# Altium schematic sheet 28PINS SCHEMATIC.SchDoc
size A2; CompanyName: (c) FEDEVEL ACADEMY 2015; SheetNumber: 3; SheetTotal: 5; NotFitted: NF; VersionRevision: V111
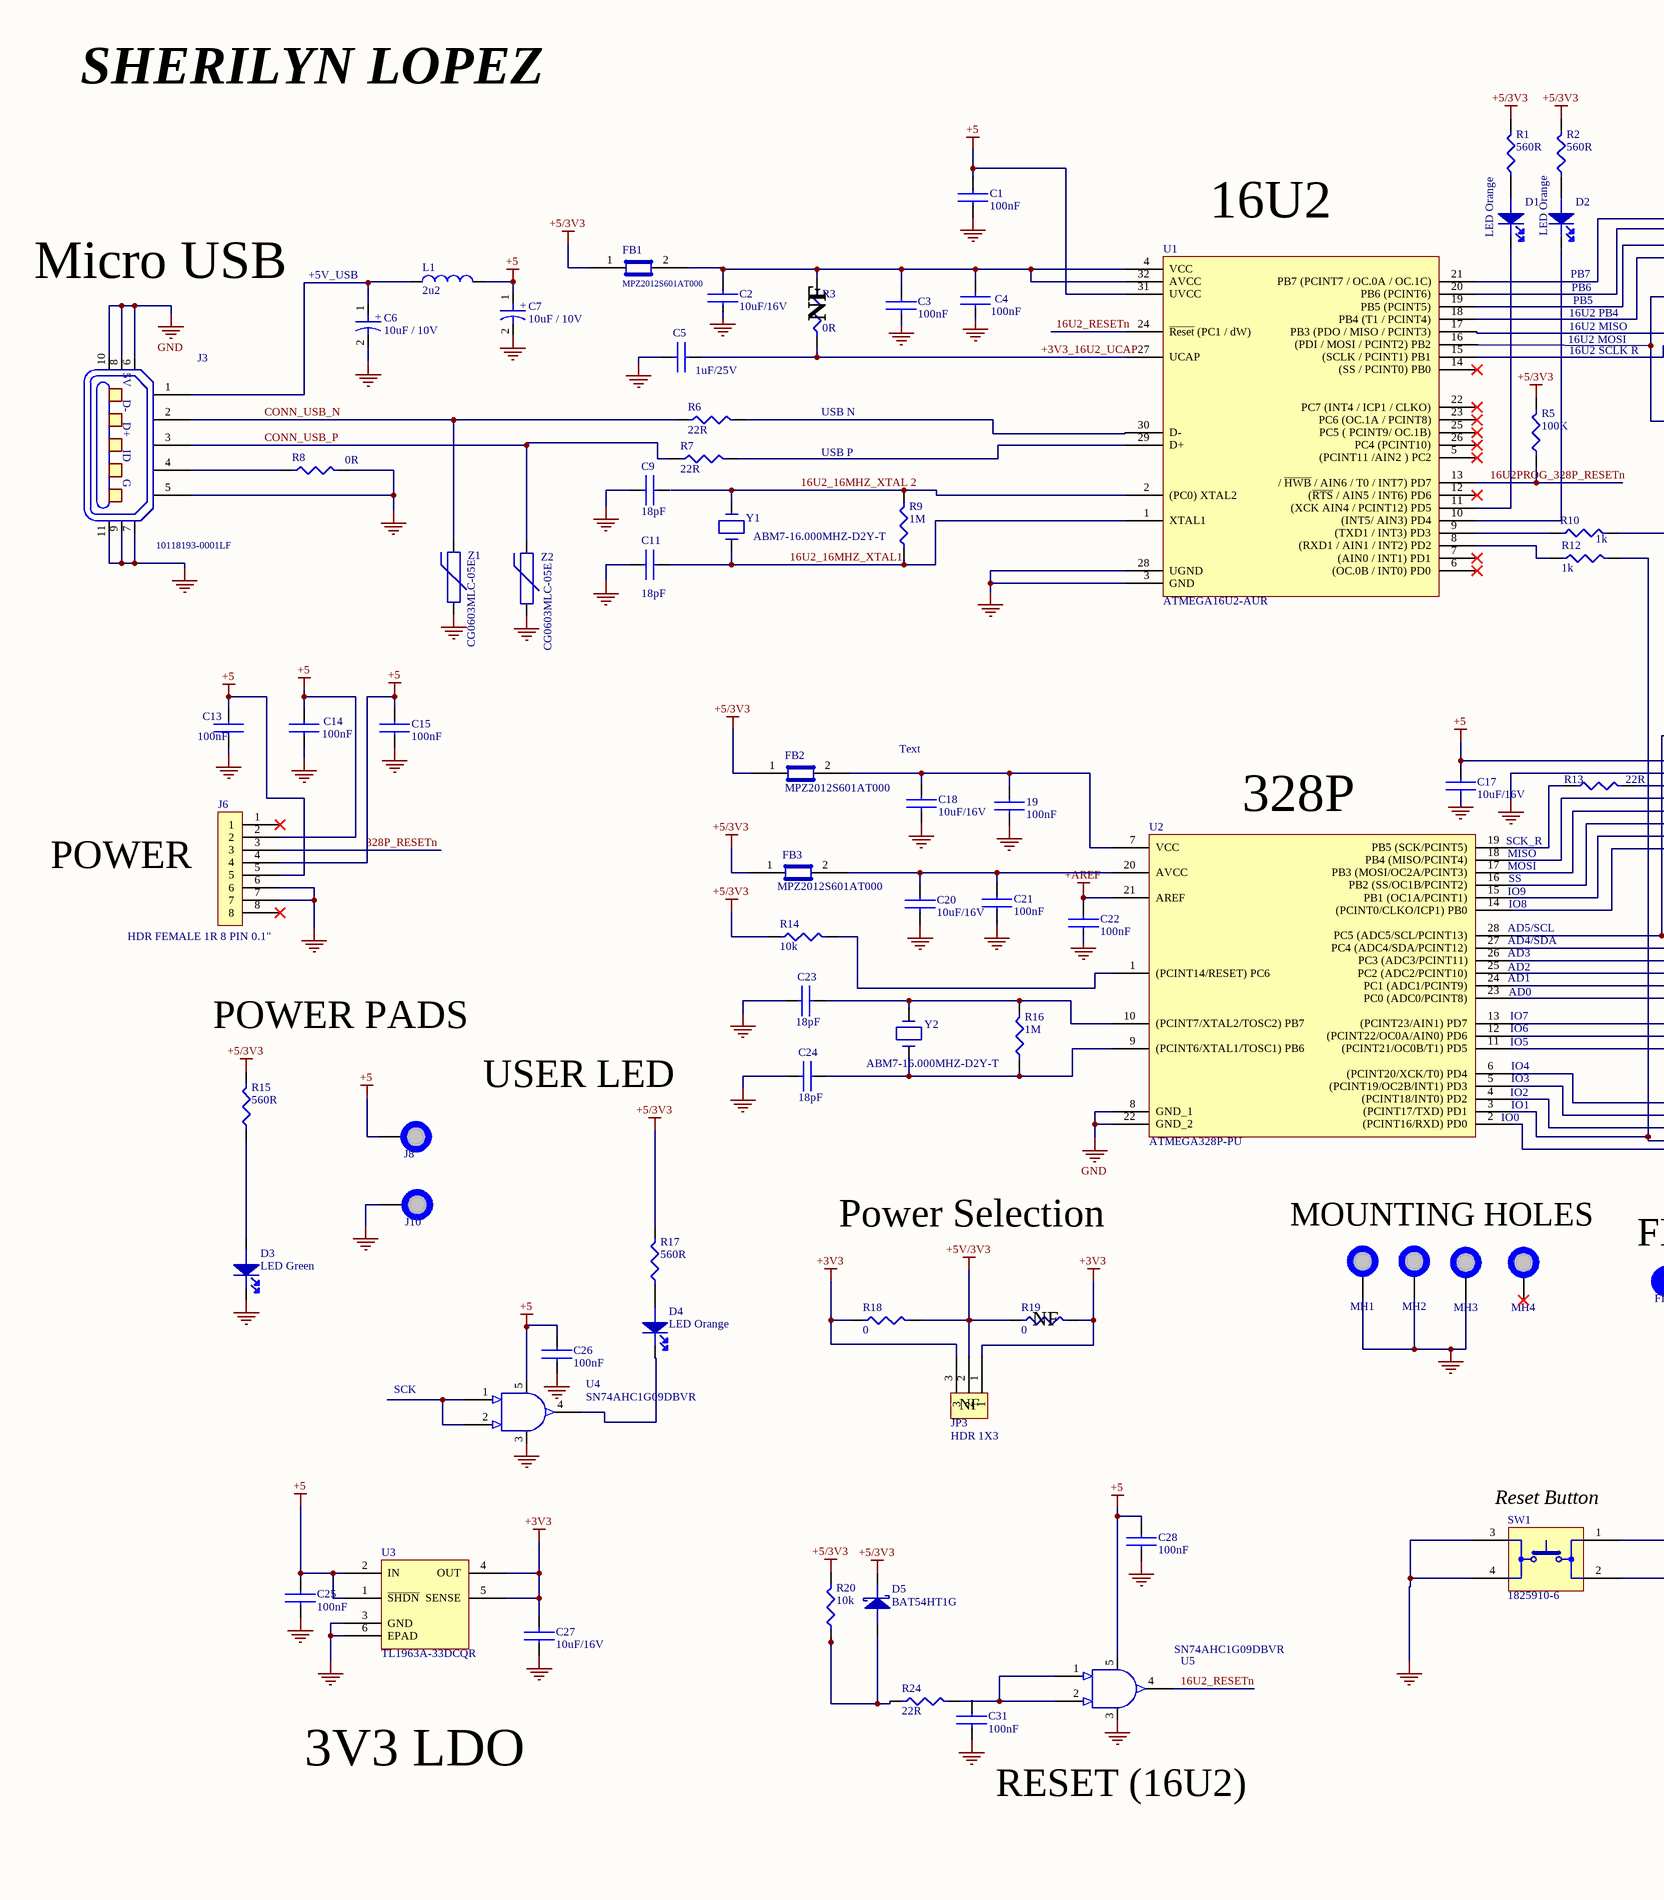
[diagram p0: 28PINS SCHEMATIC.SchDoc, left]
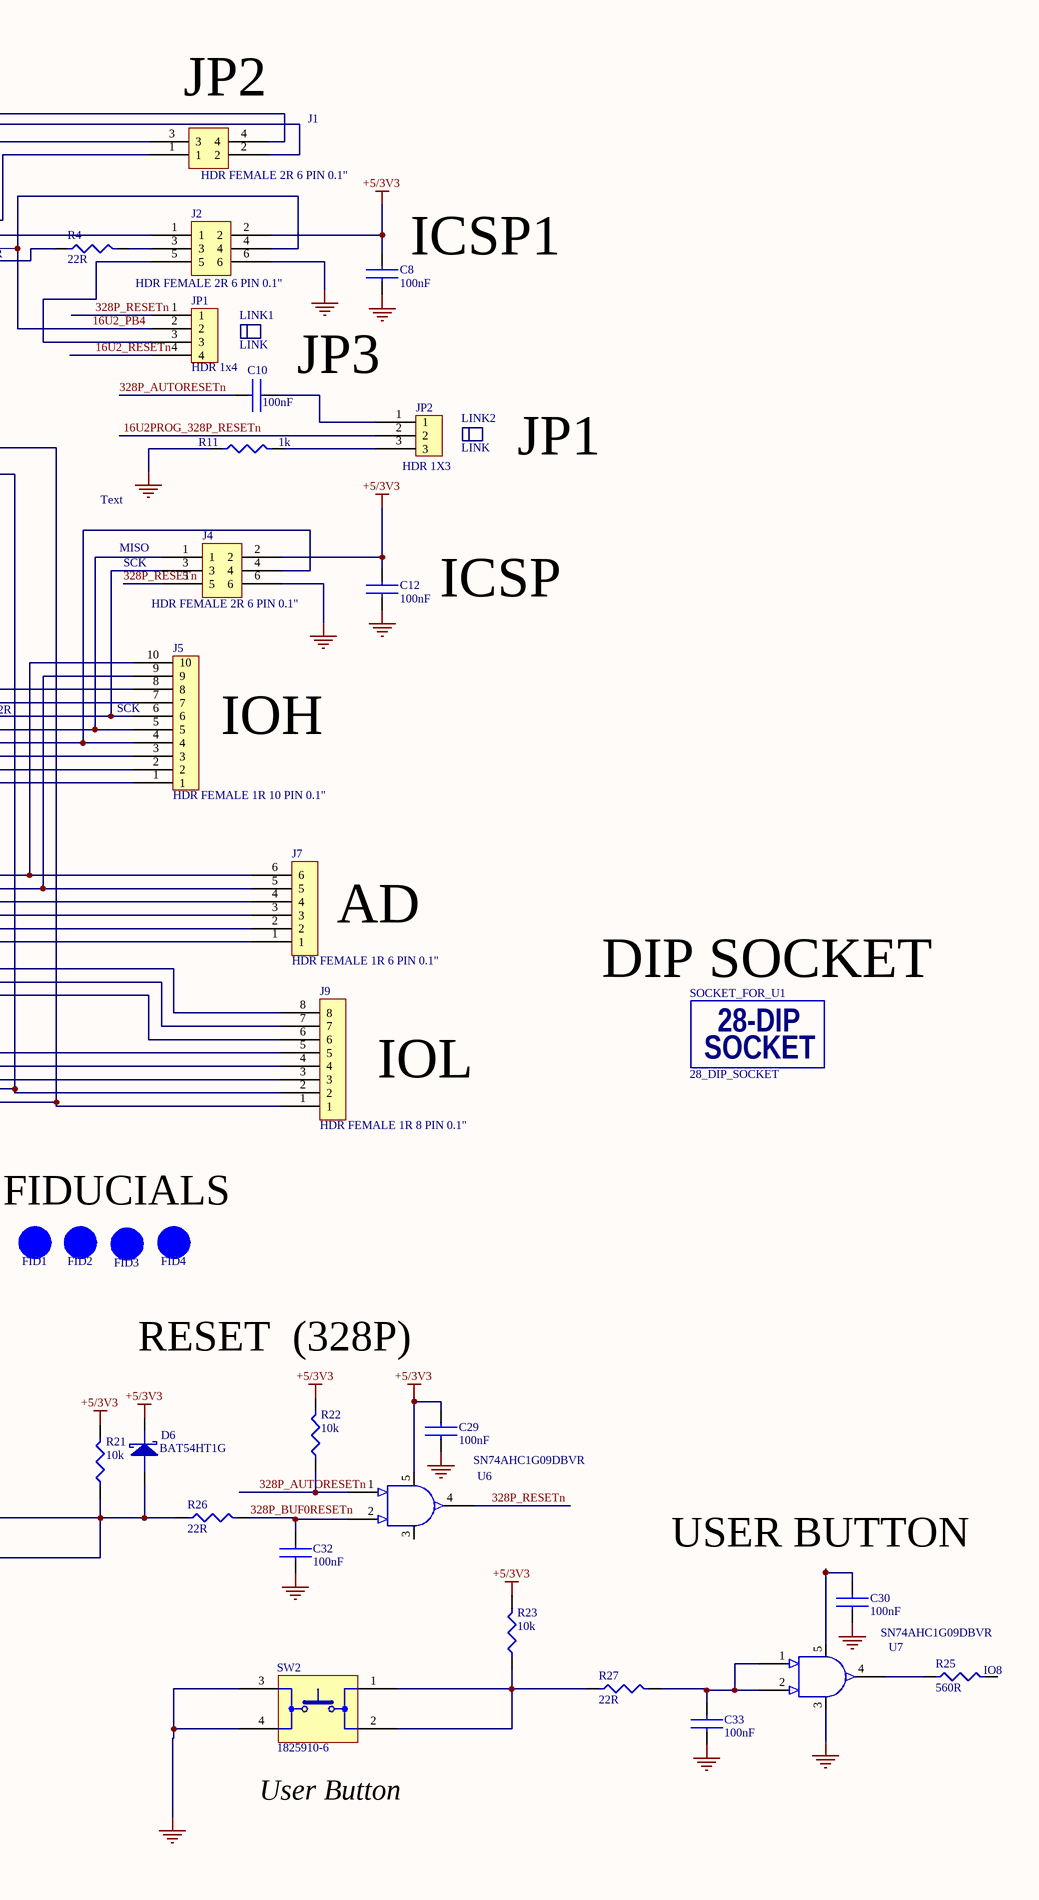
[diagram p1: 28PINS SCHEMATIC.SchDoc, right]

## Parts
19  100nF  [C0805]
C1  100nF  [C0805]
C2  10uF/16V  [C0805]
C3  100nF  [C0805]
C4  100nF  [C0805]
C5  1uF/25V  [C0805]
C6  10uF / 10V  [C_ALM_C_SIZE]
C7  10uF / 10V  [C_ALM_C_SIZE]
C8  100nF  [C0805]
C9  18pF  [C0805]
C10  100nF  [C0805]
C11  18pF  [C0805]
C12  100nF  [C0805]
C13  100nF  [C0805]
C14  100nF  [C0805]
C15  100nF  [C0805]
C17  10uF/16V  [C0805]
C18  10uF/16V  [C0805]
C20  10uF/16V  [C0805]
C21  100nF  [C0805]
C22  100nF  [C0805]
C23  18pF  [C0805]
C24  18pF  [C0805]
C25  100nF  [C0805]
C26  100nF  [C0805]
C27  10uF/16V  [C0805]
C28  100nF  [C0805]
C29  100nF  [C0805]
C30  100nF  [C0805]
C31  100nF  [C0805]
C32  100nF  [C0805]
C33  100nF  [C0805]
D1  LED Orange  [D0603]
D2  LED Orange  [D0603]
D3  LED Green  [D0603]
D4  LED Orange  [D0603]
D5  BAT54HT1G  [BAT54HT1G]
D6  BAT54HT1G  [BAT54HT1G]
FB1  MPZ2012S601AT000  [C0805]
FB2  MPZ2012S601AT000  [C0805]
FB3  MPZ2012S601AT000  [C0805]
FID1  FID_1MMC  [FID_1MMC]  (value not drawn)  (net tie, no BOM)
FID2  FID_1MMC  [FID_1MMC]  (value not drawn)  (no BOM)
FID3  FID_1MMC  [FID_1MMC]  (value not drawn)  (no BOM)
FID4  FID_1MMC  [FID_1MMC]  (value not drawn)  (no BOM)
J1  HDR FEMALE 2R 6 PIN 0.1"  [HDR_2X2_2.54MM]
J2  HDR FEMALE 2R 6 PIN 0.1"  [HDR_2X3_2.54MM]
J3  10118193-0001LF  [10118193-0001LF]
J4  HDR FEMALE 2R 6 PIN 0.1"  [HDR_2X3_2.54MM]
J5  HDR FEMALE 1R 10 PIN 0.1"  [517-929974-01-10-RK]
J6  HDR FEMALE 1R 8 PIN 0.1"  [M20-7820842]
J7  HDR FEMALE 1R 6 PIN 0.1"  [952-1809-ND]
J8  MTHOLE_7.4MMCNP_3.2MMC  [MT_HOLE_7.4MMC_3.2MMD_NON_PLATED]  (value not drawn)  (no BOM)
J9  HDR FEMALE 1R 8 PIN 0.1"  [M20-7820842]
J10  MTHOLE_7.4MMCNP_3.2MMC  [MT_HOLE_7.4MMC_3.2MMD_NON_PLATED]  (value not drawn)  (no BOM)
JP1  HDR 1x4  [68001-204HLF]
JP2  HDR 1X3  [609-3461-ND]
JP3  HDR 1X3  [609-3461-ND]
L1  2u2  [C1210_IND]
LINK1  LINK  (mechanical)
LINK2  LINK  (mechanical)
MH1  MTHOLE_7.4MMCNP_3.2MMC  [MT_HOLE_7.4MMC_3.2MMD_NON_PLATED]  (value not drawn)  (no BOM)
MH2  MTHOLE_7.4MMCNP_3.2MMC  [MT_HOLE_7.4MMC_3.2MMD_NON_PLATED]  (value not drawn)  (no BOM)
MH3  MTHOLE_7.4MMCNP_3.2MMC  [MT_HOLE_7.4MMC_3.2MMD_NON_PLATED]  (value not drawn)  (no BOM)
MH4  MTHOLE_7.4MMCNP_3.2MMC  [MT_HOLE_7.4MMC_3.2MMD_NON_PLATED]  (value not drawn)  (no BOM)
R1  560R  [R0805]
R2  560R  [R0805]
R3  0R  [R0805]
R4  22R  [R0805]
R5  100K  [R0805]
R6  22R  [R0805]
R7  22R  [R0805]
R8  0R  [R0805]
R9  1M  [R0805]
R10  1k  [R0805]
R11  1k  [R0805]
R12  1k  [R0805]
R13  22R  [R0805]
R14  10k  [R0805]
R15  560R  [R0805]
R16  1M  [R0805]
R17  560R  [R0805]
R18  0  [R0805]
R19  0  [R0805]
R20  10k  [R0805]
R21  10k  [R0805]
R22  10k  [R0805]
R23  10k  [R0805]
R24  22R  [R0805]
R25  560R  [R0805]
R26  22R  [R0805]
R27  22R  [R0805]
SOCKET_FOR_U1  28_DIP_SOCKET  [28_DIP_7.62MM_SOCKET]  (no BOM)
SW1  1825910-6  [1825910-6]
SW2  1825910-6  [1825910-6]
U1  ATMEGA16U2-AUR  [ATMEGA16U2-AURCT-ND]
U2  ATMEGA328P-PU  [ATMEGA328P-PU-ND]
U3  TL1963A-33DCQR  [DCP (R-PDSO-G6)]
U4  SN74AHC1G09DBVR  [SN74AHC1G09DBVR]
U5  SN74AHC1G09DBVR  [SN74AHC1G09DBVR]
U6  SN74AHC1G09DBVR  [SN74AHC1G09DBVR]
U7  SN74AHC1G09DBVR  [SN74AHC1G09DBVR]
Y1  ABM7-16.000MHZ-D2Y-T  [ABM7-16.000MHZ-D2Y-T]
Y2  ABM7-16.000MHZ-D2Y-T  [ABM7-16.000MHZ-D2Y-T]
Z1  CG0603MLC-05E  [R0603]
Z2  CG0603MLC-05E  [R0603]

## Nets
+3V3: C27.2 JP3.1 JP3.3 R18.1 R19.2 U3.4(OUT) U3.5(SENSE)
+5: C1.2 C7.1 C13.2 C14.2 C15.2 C17.2 C25.2 C26.2 C28.2 J5.8 J6.2 J6.4 J6.5 J8.1 L1.2 U1.31(UVCC) U3.1(~{SHDN}) U3.2(IN) U4.5 U5.5
+5/3V3: C8.2 C12.2 C29.2 D5.2 D6.2 FB1.1 FB2.1 FB3.1 J2.2 J4.2 R1.2 R2.2 R5.2 R14.1 R15.2 R17.2 R20.2 R21.2 R22.2 R23.2 U6.5
+5V/3V3: JP3.2 R18.2 R19.1
+AREF: C22.2 U2.21(AREF)
GND: 19.1 C1.1 C2.1 C3.2 C4.1 C5.1 C6.2 C7.2 C8.1 C9.2 C11.2 C12.1 C13.1 C14.1 C15.1 C17.1 C18.1 C20.1 C21.1 C22.1 C23.1 C24.1 C25.1 C26.1 C27.1 C28.1 C29.1 C30.1 C31.1 C32.1 C33.1 D3.2 J2.6 J3.5 J3.6 J3.7 J3.8 J3.9 J3.10 J3.11 J4.6 J5.7 J6.6 J6.7 J10.1 MH1.1 MH2.1 MH3.1 R8.2 R11.1 SW1.3 SW1.4 SW2.3 SW2.4 U1.3(GND) U1.28(UGND) U2.8(GND_1) U2.22(GND_2) U3.3(GND) U3.6(EPAD) U4.3 U5.3 U7.3 Z1.1 Z2.1
16U2_16MHZ_XTAL1: C11.1 R9.1 U1.1(XTAL1) Y1.1
16U2_16MHZ_XTAL 2: R9.2 U1.2((PC0)_XTAL2) Y1.2
16U2_PB4: J2.4 JP1.2 U1.16((PDI_/_MOSI_/_PCINT2)_PB2)
16U2_RESETn: JP1.4 U1.24(~{Reset}_(PC1_/_dW)) U5.4
16U2PROG_328P_RESETn: JP2.2 R5.1 U1.13(/_~{HWB}_/_AIN6_/_T0_/_INT7)_PD7)
328P_AUTORESETn: C10.1 R22.1 U6.1
328P_BUF0RESETn: C32.2 R26.2 U6.2
328P_RESETn: J4.5 J6.3 JP1.1 U6.4
+3V3_16U2_UCAP: C5.2 R3.1 U1.27(UCAP)
CONN_USB_N: J3.2 R6.1 Z1.2
CONN_USB_P: J3.3 R7.1 Z2.2
Net19_2: 19.2 C18.2 FB2.2 U2.7(VCC)
NetC2_2: C2.2 C3.1 C4.2 FB1.2 R3.2 U1.4(VCC) U1.32(AVCC)
NetC6_1: C6.1 J3.1 L1.1
NetC10_2: C10.2 JP2.1
NetC20_2: C20.2 C21.2 FB3.2 U2.20(AVCC)
NetC23_2: C23.2 R16.2 U2.10((PCINT7/XTAL2/TOSC2)_PB7) Y2.2
NetC24_2: C24.2 R16.1 U2.9((PCINT6/XTAL1/TOSC1)_PB6) Y2.1
NetC30_2: C30.2 U7.5
NetC33_2: C33.2 R27.2 U7.1 U7.2
NetD1_2: D1.2 U1.11((XCK_AIN4_/_PCINT12)_PD5)
NetD2_2: D2.2 U1.10((INT5/_AIN3)_PD4)
NetD3_1: D3.1 R15.1
NetD4_2: D4.2 U4.4
NetD5_1: D5.1 R20.1 R24.1
NetD6_1: D6.1 R21.1 R26.1 SW1.1 SW1.2
NetJ1_1: J1.1 U1.18(PB4_(T1_/_PCINT4))
NetJ1_2: J1.2 U1.20(PB6_(PCINT6))
NetJ1_3: J1.3 U1.19(PB5_(PCINT5))
NetJ1_4: J1.4 U1.21(PB7_(PCINT7_/_OC.0A_/_OC.1C))
NetJ2_1: J2.1 U1.17(PB3_(PDO_/_MISO_/_PCINT3))
NetJ2_3: J2.3 R4.2
NetJ2_5: J2.5 JP1.3
NetJ3_4: J3.4 R8.1
NetJ4_1: J4.1 J5.5 U2.18(PB4_(MISO/PCINT4))
NetJ4_3: J4.3 J5.6 R13.2
NetJ4_4: J4.4 J5.4 U2.17(PB3_(MOSI/OC2A/PCINT3))
NetJ5_1: J5.1 U2.14((PCINT0/CLKO/ICP1)_PB0)
NetJ5_2: J5.2 U2.15(PB1_(OC1A/PCINT1))
NetJ5_3: J5.3 U2.16(PB2_(SS/OC1B/PCINT2))
NetJ5_9: J5.9 J7.5 U2.27(PC4_(ADC4/SDA/PCINT12))
NetJ5_10: J5.10 J7.6 U2.28(PC5_(ADC5/SCL/PCINT13))
NetJ7_1: J7.1 U2.23(PC0_(ADC0/PCINT8))
NetJ7_2: J7.2 U2.24(PC1_(ADC1/PCINT9))
NetJ7_3: J7.3 U2.25(PC2_(ADC2/PCINT10))
NetJ7_4: J7.4 U2.26(PC3_(ADC3/PCINT11))
NetJ9_1: J9.1 R10.2 U2.2((PCINT16/RXD)_PD0)
NetJ9_2: J9.2 R12.2 U2.3((PCINT17/TXD)_PD1)
NetJ9_3: J9.3 U2.4((PCINT18/INT0)_PD2)
NetJ9_4: J9.4 U2.5((PCINT19/OC2B/INT1)_PD3)
NetJ9_5: J9.5 U2.6((PCINT20/XCK/T0)_PD4)
NetJ9_6: J9.6 U2.11((PCINT21/OC0B/T1)_PD5)
NetJ9_7: J9.7 U2.12((PCINT22/OC0A/AIN0)_PD6)
NetJ9_8: J9.8 U2.13((PCINT23/AIN1)_PD7)
NetJP2_3: JP2.3 R11.2
NetR4_1: R4.1 U1.15((SCLK_/_PCINT1)_PB1)
NetR6_2: R6.2 U1.30(D-)
NetR7_2: R7.2 U1.29(D+)
NetR10_1: R10.1 U1.9((TXD1_/_INT3)_PD3)
NetR12_1: R12.1 U1.8((RXD1_/_AIN1_/_INT2)_PD2)
NetR13_1: R13.1 U2.19(PB5_(SCK/PCINT5))
NetR14_2: R14.2 U2.1((PCINT14/RESET)_PC6)
NetR23_1: R23.1 R27.1 SW2.1 SW2.2
NetR24_2: R24.2 U5.1 U5.2
NetR25_1: R25.1 U7.4
NetU4_1: U4.1 U4.2

Not connected (* = marked no-connect by the designer): C9 1; C31 2; D1 1; D2 1; D4 1; J6 1* 8*; MH4 1*; R1 1; R2 1; R17 1; R25 2; U1 5((PCINT11_/AIN2_)_PC2)* 6((OC.0B_/_INT0)_PD0)* 7((AIN0_/_INT1)_PD1)* 12((~{RTS}_/_AIN5_/_INT6)_PD6)* 14((SS_/_PCINT0)_PB0)* 22(PC7_(INT4_/_ICP1_/_CLKO))* 23(PC6_(OC.1A_/_PCINT8))* 25(PC5_(_PCINT9/_OC.1B))* 26(PC4_(PCINT10))*; U6 3

## Notes on the sheet
- SHERILYN LOPEZ
  8-887-1386
- (near U1) 16U2
- (near J1) JP2
- Micro USB
- (near C6) +5V_USB
- (near R3) NF
- 16U2 PB4
- 16U2 MISO
- (near D2) PB7
- (near D2) PB6
- PB5
- 16U2 MOSI
- 16U2 SCLK R
- (near C8) ICSP1
- USB N
- USB P
- JP3
- (near LINK2) JP1
- Text
- MISO
- SCK
- ICSP
- (near C18) Text
- (near U2) 328P
- (near J5) SCK
- (near J5) IOH
- POWER
- (near U2) SCK_R
- (near U2) MISO
- (near U2) MOSI
- (near U2) IO9
- (near U2) SS
- (near U2) AD5/SCL
- (near U2) AD4/SDA
- (near U2) AD3
- (near U2) IO8
- (near U2) AD2
- (near U2) AD1
- (near U2) AD0
- (near U2) IO7
- (near J7) AD
- (near R15) POWER PADS
- (near U2) IO6
- (near U2) IO5
- (near U2) IO4
- (near U2) IO3
- (near SOCKET_FOR_U1) DIP SOCKET
- USER LED
- (near U2) IO0
- (near U2) IO2
- (near U2) IO1
- IOL
- Power Selection
- MOUNTING HOLES
- FIDUCIALS
- (near R19) NF
- RESET  (328P)
- (near JP3) NF
- (near SW1) Reset Button
- (near C30) USER BUTTON
- (near R25) IO8
- 3V3 LDO
- RESET (16U2)
- (near SW2) User Button
- (in symbol 4828-3004-CP) 28-DIP; SOCKET
- (in symbol 10118193-0001LF) 5V; D-; D+; ID; G
- (in symbol EEE-1AA101WR) +

## Library data of the parts
19 C1 C8 C10 C12-C15 C21 C22 C25 C26 C28-C33 = C2012X7R1H104K125AE: CAP CER 0.1UF 50V X7R 0805; Manufacturer: TDK Corporation; Tolerance: ±10%; Supplier 1: Digi-Key; Manufacturer Part Number: C2012X7R1H104K125AE; RoHS: RoHS Compliant; Category: Capacitors; Stock 1: 1115; Pricing 1: 1=0.31, 10=0.215, 100=0.122, 500=0.08612, 1000=0.07535 (USD); Packaging: Cut Tape (CT); Part Status: Active; Voltage - Rated: 50V; Temperature Coefficient: X7R; Operating Temperature: -55°C ~ 125°C; Features: Soft Termination; Ratings: -; Applications: Boardflex Sensitive; Failure Rate: -; Mounting Type: Surface Mount, MLCC; Package / Case: 0805 (2012 Metric); Size / Dimension: 0.079" L x 0.049" W (2.00mm x 1.25mm); Height - Seated (Max): -; Thickness (Max): 0.057" (1.45mm); Lead Spacing: -; Lead Style: -; ComponentLink1URL: https://product.tdk.com/info/en/catalog/datasheets/mlcc_commercial_soft_en.pdf; ComponentLink1Description: https://product.tdk.com/info/en/catalog/datasheets/mlcc_commercial_soft_en.pdf; Supplier Part Number 1: 445-15929-1-ND
C2-C5 C17 C18 C20 C27 = C2012X5R1C106M085AC: CAP CER 10UF 16V X5R 0805; Manufacturer: TDK Corporation; Tolerance: ±20%; Notification: Current market demand for these product types have resulted in fluctuating and extending lead times. Lead times may differ.; Supplier 1: Digi-Key; Manufacturer Part Number: C2012X5R1C106M085AC; RoHS: RoHS Compliant; Category: Capacitors; Stock 1: 40000; Pricing 1: 1=0.32, 10=0.219, 100=0.1111, 500=0.07602, 1000=0.06725 (USD); Packaging: Cut Tape (CT); Part Status: Active; Voltage - Rated: 16V; Temperature Coefficient: X5R; Operating Temperature: -55°C ~ 85°C; Features: Low ESL; Ratings: -; Applications: General Purpose; Failure Rate: -; Mounting Type: Surface Mount, MLCC; Package / Case: 0805 (2012 Metric); Size / Dimension: 0.079" L x 0.049" W (2.00mm x 1.25mm); Height - Seated (Max): -; Thickness (Max): 0.037" (0.95mm); Lead Spacing: -; Lead Style: -; ComponentLink1URL: https://product.tdk.com/info/en/catalog/datasheets/mlcc_commercial_general_en.pdf; ComponentLink1Description: https://product.tdk.com/info/en/catalog/datasheets/mlcc_commercial_general_en.pdf; Supplier Part Number 1: 445-7645-1-ND
C6 C7 = EEE-1AA101WR: Cap Aluminum Lytic 100uF 10V 20% (5 X 5.4mm) SMD 50mA 1000h 85C Automotive T/R; Manufacturer: Panasonic; Capacitance: 100 µF; Lifetime@Temperature: 2000 Hrs @ 85°C; Type: Can; Supplier 1: Digi-Key; Manufacturer Part Number: EEE-1AA101WR; Stock 1: 12119; Pricing 1: 1=0.33, 10=0.232, 100=0.1395, 500=0.1046 (USD); Case Size/Dimension: Ø 5 x 5.4 mm; Rated Voltage: 10 V; Operating Temp-Max: 85 °C; Operating Temp Range: -40 to +85 °C; Series: S; Ripple Current: 50 mA; ComponentLink1URL: https://datasheet.ciiva.com/2983/aba0000ce2-2983906.pdf; ComponentLink1Description: https://datasheet.ciiva.com/2983/aba0000ce2-2983906.pdf; ComponentLink2URL: https://datasheet.ciiva.com/24027/aba0000ce2-40801-24027541.pdf; ComponentLink2Description: https://datasheet.ciiva.com/24027/aba0000ce2-40801-24027541.pdf; ComponentLink3URL: https://datasheet.ciiva.com/30075/11aba0000ce2-30075303.pdf; ComponentLink3Description: https://datasheet.ciiva.com/30075/11aba0000ce2-30075303.pdf; ComponentLink4URL: https://datasheet.ciiva.com/16427/aba0000ce2-16427544.pdf; ComponentLink4Description: https://datasheet.ciiva.com/16427/aba0000ce2-16427544.pdf; ComponentLink5URL: https://datasheet.ciiva.com/14598/70255710-14598233.pdf; ComponentLink5Description: https://datasheet.ciiva.com/14598/70255710-14598233.pdf; ComponentLink6URL: https://datasheet.ciiva.com/14605/70255710-14605689.pdf; ComponentLink6Description: https://datasheet.ciiva.com/14605/70255710-14605689.pdf; ComponentLink7URL: https://datasheet.ciiva.com/11673/aba0000ce2-11673882.pdf; ComponentLink7Description: https://datasheet.ciiva.com/11673/aba0000ce2-11673882.pdf; ComponentLink8URL: https://datasheet.ciiva.com/26945/getdatasheetpartid-169213-26945071.pdf; ComponentLink8Description: https://datasheet.ciiva.com/26945/getdatasheetpartid-169213-26945071.pdf; Supplier Part Number 1: PCE3867CT-ND
C9 C11 C23 C24 = C0805C180K5GACTU: CAP CER 18PF 50V C0G/NP0 0805; Manufacturer: KEMET; Tolerance: ±10%; Temperature Coefficient: C0G, NP0; Notification: Current market demand for these product types have resulted in fluctuating and extending lead times. Lead times may differ.; Supplier 1: Digi-Key; Manufacturer Part Number: C0805C180K5GACTU; RoHS: RoHS Compliant; Category: Capacitors; Stock 1: 18409; Pricing 1: 1=0.11, 10=0.082, 100=0.0366, 500=0.02616, 1000=0.02056 (USD); Packaging: Cut Tape (CT); Part Status: Active; Voltage - Rated: 50V; Operating Temperature: -55°C ~ 125°C; Features: Low ESL; Ratings: -; Applications: General Purpose; Failure Rate: -; Mounting Type: Surface Mount, MLCC; Package / Case: 0805 (2012 Metric); Size / Dimension: 0.079" L x 0.049" W (2.00mm x 1.25mm); Height - Seated (Max): -; Thickness (Max): 0.035" (0.88mm); Lead Spacing: -; Lead Style: -; ComponentLink1URL: https://api.kemet.com/component-edge/download/datasheet/C0805C180K5GACTU.pdf; ComponentLink1Description: https://api.kemet.com/component-edge/download/datasheet/C0805C180K5GACTU.pdf; Supplier Part Number 1: 399-8030-1-ND
D1 D2 D4 = Q65110A1747: LED Uni-Color Orange 610nm Automotive 2-Pin Chip 0603(1608Metric) T/R; Manufacturer: Osram Opto; Luminous Intensity: 9mcd; Test Current (It): 2mA; Forward Current: 20mA; Dominant Wave Length: 606nm; Viewing Angle: 160°; Luminous Flux: 0.025lm; Forward Voltage: 2.2V; Product Length (mm): 1.3mm; Product Height (mm): 0.65mm; Product Depth (mm): 0.8mm; Shape Type: Rectangular; Chip Material: AlGaInP; Main Category: Chip LED; Number of  Elements: 1; Lens Type: Colorless Diffused; Reverse Voltage: 12V; Supplier 1: Digi-Key; Manufacturer Part Number: Q65110A1747; Stock 1: 11660; Pricing 1: 1=0.49, 10=0.35, 25=0.286, 100=0.2287, 250=0.193, 500=0.1644, 1000=0.1287, 2500=0.1179 (USD); Package Type: SMT; Emitting Color: Orange; Mounting: Surface Mount; Packaging: Tape and Reel; Peak Wavelength: 610nm; Pin Count: 2; Operating Temperature Classification: Industrial; Type: Uni-Color; Operating Temp Range: -40C to 100C; Lens Dimensions: 1.3x0.8x0.525mm; ComponentLink1URL: https://datasheet.ciiva.com/15198/getdatasheetpartid-693885-15198412.pdf; ComponentLink1Description: https://datasheet.ciiva.com/15198/getdatasheetpartid-693885-15198412.pdf; Supplier Part Number 1: 475-2740-1-ND
D3 = LGL29K-G2J1-24-Z: LED GREEN DIFFUSED 0603 SMD; Manufacturer: Osram Opto; Catalog Drawings: SmartLED SMD Side / SmartLED Top Wide Leads; Millicandela Rating: 3.92mcd; Voltage - Forward (Vf) Typ: 1.7V; Current - Test: 2mA; Wavelength - Dominant: 570nm; Wavelength - Peak: 572nm; Viewing Angle: 160°; Lens Style/Size: Rectangle with Flat Top, 1.3mm x 0.8mm; Luminous Flux @ Current - Test: 12 mlm; Dynamic Catalog: Surface Mount; Other Names: 475-2709-6; Supplier 1: Digi-Key; Manufacturer Part Number: LGL29K-G2J1-24-Z; Stock 1: 645331; Pricing 1: 1=0.56, 10=0.403, 25=0.3292, 100=0.2633, 250=0.2222, 500=0.1893, 1000=0.1481, 2500=0.1358 (USD); Standard Package: 1; Category: Optoelectronics; Family: LEDs - Discrete; Series: SmartLED; Color: Green; Lens Type: Diffused; Package / Case: 0603 (1608 Metric); Size / Dimension: 1.70mm L x 0.80mm W; Height: 0.65mm; Mounting Type: Surface Mount; Packaging: Digi-Reel®; ComponentLink1URL: https://datasheet.ciiva.com/4689/g-l29k-39844-4689584.pdf; ComponentLink1Description: https://datasheet.ciiva.com/4689/g-l29k-39844-4689584.pdf; ComponentLink2URL: https://datasheet.ciiva.com/2112/00077107-0-2112886.pdf; ComponentLink2Description: https://datasheet.ciiva.com/2112/00077107-0-2112886.pdf; ComponentLink3URL: https://datasheet.ciiva.com/2112/00077107-0-2112887.pdf; ComponentLink3Description: https://datasheet.ciiva.com/2112/00077107-0-2112887.pdf; ComponentLink4URL: https://datasheet.ciiva.com/2112/00077107-0-2112888.pdf; ComponentLink4Description: https://datasheet.ciiva.com/2112/00077107-0-2112888.pdf; Supplier Part Number 1: 475-2709-1-ND
D5 D6 = BAT54HT1G: DIODE SCHOTTKY 30V 200MA SOD323; Manufacturer: ON Semiconductor; Current - Average Rectified (Io): 200mA (DC); Speed: Small Signal =< 200mA (Io), Any Speed; Capacitance @ Vr, F: 10pF @ 1V, 1MHz; Supplier 1: Digi-Key; Manufacturer Part Number: BAT54HT1G; RoHS: RoHS Compliant; Category: Discrete Semiconductor Products; Stock 1: 340550; Pricing 1: 1=0.28, 10=0.225, 100=0.1195, 500=0.07862, 1000=0.05346 (USD); Packaging: Cut Tape (CT); Part Status: Active; Diode Type: Schottky; Mounting Type: Surface Mount; Package / Case: SC-76, SOD-323; Supplier Device Package: SOD-323; Operating Temperature - Junction: -55°C ~ 150°C; Base Part Number: BAT54H; ComponentLink1URL: http://www.onsemi.com/pub/Collateral/BAT54HT1-D.PDF; ComponentLink1Description: http://www.onsemi.com/pub/Collateral/BAT54HT1-D.PDF; Supplier Part Number 1: BAT54HT1GOSCT-ND
FB1-FB3 = MPZ2012S601AT000: FERRITE BEAD 600 OHM 0805 1LN; Manufacturer: TDK Corporation; Filter Type: Power Line; Current Rating (Max): 2A; DC Resistance (DCR) (Max): 100 mOhm; Supplier 1: Digi-Key; Manufacturer Part Number: MPZ2012S601AT000; RoHS: RoHS Compliant; Category: Filters; Stock 1: 506; Pricing 1: 1=0.11, 10=0.091, 25=0.0704, 50=0.0584, 100=0.0503, 250=0.04028, 500=0.03624, 1000=0.0302 (USD); Packaging: Cut Tape (CT); Part Status: Active; Ratings: -; Operating Temperature: -55°C ~ 125°C; Package / Case: 0805 (2012 Metric); Mounting Type: Surface Mount; Height (Max): 0.041" (1.05mm); Size / Dimension: 0.079" L x 0.049" W (2.00mm x 1.25mm); ComponentLink1URL: https://product.tdk.com/info/en/catalog/datasheets/beads_commercial_power_mpz2012_en.pdf; ComponentLink1Description: https://product.tdk.com/info/en/catalog/datasheets/beads_commercial_power_mpz2012_en.pdf; Supplier Part Number 1: 445-2206-1-ND
FID1-FID4 = FIDUCIAL_1MMC: Fiducial 40mil Diameter, 120mil Mask
J1 = 929836-01-02-RK: CONN HEADER 4POS DUAL .100 TIN; Manufacturer: 3M; Pitch - Mating: 0.100" (2.54mm); Number of Positions: 4; Number of Positions Loaded: All; Style: Board to Board; Shrouding: Unshrouded; Contact Length - Mating: 0.235" (5.97mm); Contact Length - Post: 0.110" (2.79mm); Overall Contact Length: 0.445" (11.30mm); Material Flammability Rating: UL94 V-0; Current Rating: 2.5A; Supplier 1: Digi-Key; Manufacturer Part Number: 929836-01-02-RK; RoHS: RoHS Compliant; Category: Connectors, Interconnects; Stock 1: 170; Pricing 1: 1=0.66, 10=0.592, 100=0.4876, 500=0.38544, 1000=0.33087, 5000=0.30185, 10000=0.29024 (USD); Packaging: Bulk; Part Status: Active; Connector Type: Header; Contact Type: Male Pin; Number of Rows: 2; Row Spacing - Mating: 0.100" (2.54mm); Mounting Type: Through Hole; Termination: Solder; Fastening Type: Push-Pull; Insulation Height: 0.100" (2.54mm); Contact Shape: Square; Contact Finish - Mating: Tin; Contact Finish Thickness - Mating: 200.0µin (5.08µm); Contact Finish - Post: Tin; Contact Material: Copper Alloy; Insulation Material: Polycyclohexylenedimethylene Terephthalate (PCT); Features: -; Operating Temperature: -40°C ~ 105°C; Ingress Protection: -; Insulation Color: Black; Voltage Rating: -; Mated Stacking Heights: -; Contact Finish Thickness - Post: -; Applications: -; ComponentLink1URL: http://multimedia.3m.com/mws/media/43897O/3mtmpinstriphdr-100-100x-100-929-series-ts0769.pdf; ComponentLink1Description: http://multimedia.3m.com/mws/media/43897O/3mtmpinstriphdr-100-100x-100-929-series-ts0769.pdf; Supplier Part Number 1: 3M156386-04-ND
J2 J4 = 67996-406HLF: CONN HEADER 6POS .100 STR TIN; Manufacturer: Amphenol FCI; Pitch - Mating: 0.100" (2.54mm); Number of Positions: 6; Number of Positions Loaded: All; Style: Board to Board; Shrouding: Unshrouded; Contact Length - Mating: 0.230" (5.84mm); Contact Length - Post: 0.095" (2.41mm); Overall Contact Length: 0.425" (10.80mm); Material Flammability Rating: UL94 V-0; Supplier 1: Digi-Key; Manufacturer Part Number: 67996-406HLF; RoHS: RoHS Compliant; Category: Connectors, Interconnects; Stock 1: 32498; Pricing 1: 1=0.29, 10=0.271, 100=0.1894, 500=0.16234, 1000=0.13528, 5000=0.11595, 10000=0.10822 (USD); Packaging: Bulk; Part Status: Active; Connector Type: Header; Contact Type: Male Pin; Number of Rows: 2; Row Spacing - Mating: 0.100" (2.54mm); Mounting Type: Through Hole; Termination: Solder; Fastening Type: Push-Pull; Insulation Height: 0.100" (2.54mm); Contact Shape: Square; Contact Finish - Mating: Tin; Contact Finish Thickness - Mating: 100.0µin (2.54µm); Contact Finish - Post: Tin; Contact Material: Phosphor Bronze; Insulation Material: -; Features: -; Operating Temperature: -; Ingress Protection: -; Insulation Color: Black; Current Rating: -; Voltage Rating: -; Mated Stacking Heights: -; Contact Finish Thickness - Post: -; Applications: -; ComponentLink1URL: https://cdn.amphenol-icc.com/media/wysiwyg/files/drawing/67996.pdf; ComponentLink1Description: https://cdn.amphenol-icc.com/media/wysiwyg/files/drawing/67996.pdf; Supplier Part Number 1: 609-3218-ND
J3 = 10118193-0001LF: USB - micro B USB 2.0 Receptacle Connector 5 Position Surface Mount, Right Angle, Horizontal; Manufacturer: Amphenol FCI; Number of Contacts: 5 Contact; Gender: Female; Current Rating: 1.8 A; Brand: FCI; Connector Type: Micro USB Type B receptacle; Insulation Resistance: 1000 MOhms; Supplier 1: Digi-Key; Manufacturer Part Number: 10118193-0001LF; Stock 1: 117141; Pricing 1: 1=0.42, 10=0.393, 25=0.3536, 50=0.3144, 100=0.3013, 250=0.2751, 500=0.262 (USD); Product Category: USB Connectors; RoHS: Details; Product: Micro USB Type B Connectors; Standard: USB 2.0; Termination Style: SMD/SMT; Color: Black; Contact Material: Copper Alloy; Contact Plating: Gold; Flammability Rating: UL 94 V-0; Mounting Angle: Right; Operating Temperature Range: - 55 C to + 85 C; Packaging: Reel; Factory Pack Quantity: 1200; ComponentLink1URL: https://datasheet.ciiva.com/851/10118193-851106.pdf; ComponentLink1Description: https://datasheet.ciiva.com/851/10118193-851106.pdf; ComponentLink2URL: https://datasheet.ciiva.com/14802/10118193-0001lf-webpage-14802386.pdf; ComponentLink2Description: https://datasheet.ciiva.com/14802/10118193-0001lf-webpage-14802386.pdf; ComponentLink3URL: https://datasheet.ciiva.com/851/10118193-851107.pdf; ComponentLink3Description: https://datasheet.ciiva.com/851/10118193-851107.pdf; ComponentLink4URL: https://datasheet.ciiva.com/851/10118193-851108.pdf; ComponentLink4Description: https://datasheet.ciiva.com/851/10118193-851108.pdf; ComponentLink5URL: https://datasheet.ciiva.com/26853/getdatasheetpartid-418618-26853893.pdf; ComponentLink5Description: https://datasheet.ciiva.com/26853/getdatasheetpartid-418618-26853893.pdf; ComponentLink6URL: https://datasheet.ciiva.com/14618/70236827-14618887.pdf; ComponentLink6Description: https://datasheet.ciiva.com/14618/70236827-14618887.pdf; ComponentLink7URL: https://datasheet.ciiva.com/4598/10118193ac-197151-4598799.pdf; ComponentLink7Description: https://datasheet.ciiva.com/4598/10118193ac-197151-4598799.pdf; Supplier Part Number 1: 609-4616-1-ND
J5 = 929974-01-10-RK: CONN RECEPT .100 SNGL STR 10POS; Manufacturer: 3M; Connector Type: Receptacle; Style: Board to Board; Number of Positions: 10; Number of Positions Loaded: All; Pitch - Mating: 0.100" (2.54mm); Contact Length - Post: 0.125" (3.18mm); Material Flammability Rating: UL94 V-0; Current Rating: 2A; Voltage Rating: 1500V; Supplier 1: Digi-Key; Manufacturer Part Number: 929974-01-10-RK; RoHS: RoHS Compliant; Category: Connectors, Interconnects; Stock 1: 1070; Pricing 1: 1=1.17, 10=1.048, 100=0.8633, 500=0.68242, 1000=0.58582, 5000=0.53443, 10000=0.51388 (USD); Packaging: Bulk; Part Status: Active; Contact Type: Forked; Row Spacing - Mating: -; Mounting Type: Through Hole; Termination: Solder; Fastening Type: Push-Pull; Contact Finish - Mating: Tin; Contact Finish Thickness - Mating: 100.0µin (2.54µm); Insulation Color: Black; Insulation Height: 0.325" (8.25mm); Operating Temperature: -40°C ~ 105°C; Contact Finish - Post: Tin; Mated Stacking Heights: -; Ingress Protection: -; Features: -; Applications: -; Insulation Material: Polycyclohexylenedimethylene Terephthalate (PCT), Glass Filled; Contact Shape: Square; Contact Material: Copper Alloy; Contact Finish Thickness - Post: 100.0µin (2.54µm); ComponentLink1URL: http://multimedia.3m.com/mws/media/22500O/3mtm-boardmount-skt-100-100x-100strt-sldr-tails-ts0815.pdf; ComponentLink1Description: http://multimedia.3m.com/mws/media/22500O/3mtm-boardmount-skt-100-100x-100strt-sldr-tails-ts0815.pdf; Supplier Part Number 1: 929974E-01-10-ND
J6 J9 = M20-7820842: 08-WAY SIL VERT SOCKET L/FREE; Manufacturer: Harwin Inc.; Connector Type: Receptacle; Style: Board to Board or Cable; Number of Positions: 8; Number of Positions Loaded: All; Pitch - Mating: 0.100" (2.54mm); Contact Length - Post: 0.118" (3.00mm); Material Flammability Rating: UL94 V-0; Mated Stacking Heights: 11.04mm, 12.63mm; Current Rating: 3A; Voltage Rating: 1000V; Supplier 1: Digi-Key; Manufacturer Part Number: M20-7820842; RoHS: RoHS Compliant; Category: Connectors, Interconnects; Stock 1: 2004; Pricing 1: 1=1.1, 10=0.972, 100=0.8382, 500=0.6858, 1000=0.6096, 5000=0.5334, 10000=0.50673 (USD); Packaging: Tube; Part Status: Active; Contact Type: Female Socket; Row Spacing - Mating: -; Mounting Type: Through Hole; Termination: Solder; Fastening Type: Push-Pull; Contact Finish - Mating: Gold; Contact Finish Thickness - Mating: Flash; Insulation Color: Black; Insulation Height: 0.335" (8.51mm); Operating Temperature: -40°C ~ 105°C; Contact Finish - Post: Tin; Ingress Protection: -; Features: -; Applications: General Purpose, Industrial, Telecommunications; Insulation Material: Polyamide (PA6T), Nylon 6T; Contact Shape: Square; Contact Material: Phosphor Bronze; Contact Finish Thickness - Post: -; ComponentLink1URL: https://cdn.harwin.com/pdfs/M20-782.pdf; ComponentLink1Description: https://cdn.harwin.com/pdfs/M20-782.pdf; Supplier Part Number 1: 952-1823-ND
J7 = M20-7820646: 06-WAY SIL VERT SOCKET L/FREE; Manufacturer: Harwin Inc.; Connector Type: Receptacle; Style: Board to Board or Cable; Number of Positions: 6; Number of Positions Loaded: All; Pitch - Mating: 0.100" (2.54mm); Contact Length - Post: 0.118" (3.00mm); Material Flammability Rating: UL94 V-0; Mated Stacking Heights: 11.04mm, 12.63mm; Current Rating: 3A; Voltage Rating: 1000V; Supplier 1: Digi-Key; Manufacturer Part Number: M20-7820646; RoHS: RoHS Compliant; Category: Connectors, Interconnects; Stock 1: 2873; Pricing 1: 1=0.96, 10=0.842, 100=0.726, 500=0.594, 1000=0.528, 5000=0.462, 10000=0.4389 (USD); Packaging: Tube; Part Status: Active; Contact Type: Female Socket; Row Spacing - Mating: -; Mounting Type: Through Hole; Termination: Solder; Fastening Type: Push-Pull; Contact Finish - Mating: Tin; Contact Finish Thickness - Mating: -; Insulation Color: Black; Insulation Height: 0.335" (8.51mm); Operating Temperature: -40°C ~ 105°C; Contact Finish - Post: Tin; Ingress Protection: -; Features: -; Applications: General Purpose, Industrial, Telecommunications; Insulation Material: Polyamide (PA6T), Nylon 6T; Contact Shape: Square; Contact Material: Phosphor Bronze; Contact Finish Thickness - Post: -; ComponentLink1URL: https://cdn.harwin.com/pdfs/M20-782.pdf; ComponentLink1Description: https://cdn.harwin.com/pdfs/M20-782.pdf; Supplier Part Number 1: 952-1809-ND
J8 J10 MH1-MH4 = MTHOLE_7.4MMCNP_3.2MMC: Mounting Hole 7.4mm Diameter (Non Copper) 3.2mm Drill (Non Plated)
JP1 = 68001-204HLF: 4 Positions Header, Unshrouded Connector 0.100" (2.54mm) Through Hole Gold or Gold, GXT™; Manufacturer: Amphenol FCI; Rad Hard: No; Number of Contacts: 4; Supplier 1: Mouser; Manufacturer Part Number: 68001-204HLF; Stock 1: 8550; Pricing 1: 1=0.35, 10=0.241, 50=0.241, 100=0.232, 1000=0.166, 10000=0.133 (USD); Packaging: Bulk; Type: Unshrouded Header; Pitch: 2.54 mm; Number of Rows: 1; Gender: HDR; Contact Plating: Gold Over Nickel|GXT Over Nickel; Termination Method: Solder; Category: Connector Headers and PCB Receptacles; ComponentLink1URL: https://datasheet.ciiva.com/726/68000-726529.pdf; ComponentLink1Description: https://datasheet.ciiva.com/726/68000-726529.pdf; ComponentLink2URL: https://datasheet.ciiva.com/5164/68000-274255-5164127.pdf; ComponentLink2Description: https://datasheet.ciiva.com/5164/68000-274255-5164127.pdf; Supplier Part Number 1: 649-68001-204HLF
JP2 JP3 = 68000-103HLF: BERGSTIK II .100" SR STRAIGHT; Manufacturer: Amphenol FCI; Connector Type: Header; Pitch - Mating: 0.100" (2.54mm); Number of Positions: 3; Number of Positions Loaded: All; Style: Board to Board; Shrouding: Unshrouded; Contact Length - Mating: 0.230" (5.84mm); Contact Length - Post: 0.095" (2.41mm); Overall Contact Length: 0.425" (10.80mm); Material Flammability Rating: UL94 V-0; Supplier 1: Digi-Key; Manufacturer Part Number: 68000-103HLF; RoHS: RoHS Compliant; Category: Connectors, Interconnects; Stock 1: 37099; Pricing 1: 1=0.29, 10=0.271, 100=0.1894, 500=0.16234, 1000=0.13528, 5000=0.11595, 10000=0.10822 (USD); Packaging: Bulk; Part Status: Active; Contact Type: Male Pin; Number of Rows: 1; Row Spacing - Mating: -; Mounting Type: Through Hole; Termination: Solder; Fastening Type: Push-Pull; Insulation Height: 0.100" (2.54mm); Contact Shape: Square; Contact Finish - Mating: Gold or Gold, GXT™; Contact Finish Thickness - Mating: 30.0µin (0.76µm); Contact Finish - Post: -; Contact Material: Phosphor Bronze; Insulation Material: -; Features: -; Operating Temperature: -; Ingress Protection: -; Insulation Color: Black; Current Rating: -; Voltage Rating: -; Mated Stacking Heights: -; Contact Finish Thickness - Post: -; Applications: -; ComponentLink1URL: https://cdn.amphenol-icc.com/media/wysiwyg/files/drawing/68000.pdf; ComponentLink1Description: https://cdn.amphenol-icc.com/media/wysiwyg/files/drawing/68000.pdf; Supplier Part Number 1: 609-3461-ND
L1 = L1210R2R2MDWIT: Inductor Chip Wirewound 2.2uH 20% 100KHz 1.13A 80mOhm DCR 1210 T/R; Manufacturer: KEMET; Maximum DC Resistance: 80(Typ) mOhm; Rad Hard: No; Product Depth: 2.7 mm; Supplier 1: Digi-Key; Manufacturer Part Number: L1210R2R2MDWIT; Stock 1: 7275; Pricing 1: 1=0.55, 10=0.479, 100=0.3421, 500=0.2874 (USD); Package/Case: 1210; Type: Chip; Inductance: 2.2 uH; Maximum DC Current: 1.13 A; Tolerance: 20 %; Product Height: 2.7 mm; ComponentLink1URL: https://datasheet.ciiva.com/4957/f3115-4957838.pdf; ComponentLink1Description: https://datasheet.ciiva.com/4957/f3115-4957838.pdf; ComponentLink2URL: https://datasheet.ciiva.com/17280/f3115-17280270.pdf; ComponentLink2Description: https://datasheet.ciiva.com/17280/f3115-17280270.pdf; ComponentLink3URL: https://datasheet.ciiva.com/22685/27262-22685038.pdf; ComponentLink3Description: https://datasheet.ciiva.com/22685/27262-22685038.pdf; ComponentLink4URL: https://datasheet.ciiva.com/6691/f3115-6691487.pdf; ComponentLink4Description: https://datasheet.ciiva.com/6691/f3115-6691487.pdf; ComponentLink5URL: https://datasheet.ciiva.com/8512/f3115-8512543.pdf; ComponentLink5Description: https://datasheet.ciiva.com/8512/f3115-8512543.pdf; Supplier Part Number 1: 399-9598-1-ND
LINK1 LINK2 = 969102-0000-DA: SHUNT JUMPER .1" BLACK GOLD; Manufacturer: 3M; Part # Aliases: 05111994052 DE500057646; Accessory Type: Jumper (Shunt); Number of Positions: 2 Position; Pitch: 2.54 mm; Mounting Angle: Straight; Brand: 3M Electronic Solutions Division; Current Rating: 2 A; Voltage Rating: 1 kV; Supplier 1: Allied Electronics; Manufacturer Part Number: 969102-0000-DA; Stock 1: 0; Pricing 1: 1=0.05, 5=0.04, 100=0.03 (USD); Product Category: Headers & Wire Housings; RoHS: True; Product: Accessories; Termination Style: Through Hole; Contact Plating: Gold; Series: 969; Contact Material: Copper Alloy; Housing Material: Thermoplastic; Operating Temperature Range: - 25 C to + 105 C; Packaging: Bulk; ComponentLink1URL: https://datasheet.ciiva.com/28435/ts2186-28435329.pdf; ComponentLink1Description: https://datasheet.ciiva.com/28435/ts2186-28435329.pdf; ComponentLink2URL: https://datasheet.ciiva.com/14620/70237757-14620247.pdf; ComponentLink2Description: https://datasheet.ciiva.com/14620/70237757-14620247.pdf; ComponentLink3URL: https://datasheet.ciiva.com/3120/ts2186-3120203.pdf; ComponentLink3Description: https://datasheet.ciiva.com/3120/ts2186-3120203.pdf; ComponentLink4URL: https://datasheet.ciiva.com/5158/ts2186-5158299.pdf; ComponentLink4Description: https://datasheet.ciiva.com/5158/ts2186-5158299.pdf; ComponentLink5URL: https://datasheet.ciiva.com/767/ts2186-767868.pdf; ComponentLink5Description: https://datasheet.ciiva.com/767/ts2186-767868.pdf; Supplier Part Number 1: 70237757
R1-R3 R15 R17 R25 = RC0805FR-07560RL: RES SMD 560 OHM 1% 1/8W 0805; Manufacturer: Yageo; Resistance: 560 Ohms; Power Rating: 125 mW (1/8 W); Temperature Coefficient: 100 PPM / C; Voltage Rating: 150 V; Unit Weight: 0.000194 oz; Supplier 1: Digi-Key; Manufacturer Part Number: RC0805FR-07560RL; Stock 1: 149317; Pricing 1: 1=0.1, 10=0.046, 100=0.0186, 1000=0.0084, 2500=0.0073 (USD); Product Category: Thick Film Resistors; RoHS: True; Brand: Yageo; Tolerance: 1 %; Case Code - in: 0805; Case Code - mm: 2012; Operating Temperature Range: - 55 C to + 155 C; Series: RC; Height: 0.5 mm; Length: 2 mm; Package / Case: 0805 (2012 metric); Packaging: Reel; Product: Thick Film Resistors General Purpose; Termination Style: SMD/SMT; Type: General Purpose Chip Resistor Surface Mount; Width: 1.25 mm; ComponentLink1URL: https://datasheet.ciiva.com/11808/0900766b8106beab-11808370.pdf; ComponentLink1Description: https://datasheet.ciiva.com/11808/0900766b8106beab-11808370.pdf; ComponentLink2URL: https://datasheet.ciiva.com/2457/pyu-r-int-thick-7-2457140.pdf; ComponentLink2Description: https://datasheet.ciiva.com/2457/pyu-r-int-thick-7-2457140.pdf; ComponentLink3URL: https://datasheet.ciiva.com/2457/pyu-r-int-thick-7-2457141.pdf; ComponentLink3Description: https://datasheet.ciiva.com/2457/pyu-r-int-thick-7-2457141.pdf; ComponentLink4URL: https://datasheet.ciiva.com/5561/rc0805-5561861.pdf; ComponentLink4Description: https://datasheet.ciiva.com/5561/rc0805-5561861.pdf; ComponentLink5URL: https://datasheet.ciiva.com/7941/444164-7941813.pdf; ComponentLink5Description: https://datasheet.ciiva.com/7941/444164-7941813.pdf; ComponentLink6URL: https://datasheet.ciiva.com/2457/pyu-r-int-thick-7-2457142.pdf; ComponentLink6Description: https://datasheet.ciiva.com/2457/pyu-r-int-thick-7-2457142.pdf; ComponentLink7URL: https://datasheet.ciiva.com/7941/444164-7941814.pdf; ComponentLink7Description: https://datasheet.ciiva.com/7941/444164-7941814.pdf; Supplier Part Number 1: 311-560CRCT-ND
R4 R6 R7 R13 R24 R26 R27 = RC0805FR-0722RL: RES SMD 22 OHM 1% 1/8W 0805; Manufacturer: Yageo; Power (Watts): 0.125W, 1/8W; Temperature Coefficient: ±100ppm/°C; Supplier 1: Digi-Key; Manufacturer Part Number: RC0805FR-0722RL; RoHS: RoHS Compliant; Category: Resistors; Stock 1: 624328; Pricing 1: 1=0.1, 10=0.046, 100=0.0186, 1000=0.00835, 2500=0.00725 (USD); Packaging: Cut Tape (CT); Part Status: Active; Tolerance: ±1%; Composition: Thick Film; Features: Moisture Resistant; Operating Temperature: -55°C ~ 155°C; Package / Case: 0805 (2012 Metric); Supplier Device Package: 0805; Size / Dimension: 0.079" L x 0.049" W (2.00mm x 1.25mm); Height - Seated (Max): 0.024" (0.60mm); Failure Rate: -; ComponentLink1URL: http://www.yageo.com/documents/recent/PYu-RC_Group_51_RoHS_L_9.pdf; ComponentLink1Description: http://www.yageo.com/documents/recent/PYu-RC_Group_51_RoHS_L_9.pdf; Supplier Part Number 1: 311-22.0CRCT-ND
R5 = RT0805FRE07100KL: RES SMD 100K OHM 1% 1/8W 0805; Manufacturer: Yageo; Resistance: 100 kOhms; Temperature Coefficient: 50 PPM / C; Power Rating: 125 mW (1/8 W); Voltage Rating: 150 V; Supplier 1: Farnell; Manufacturer Part Number: RT0805FRE07100KL; Stock 1: 9457; Pricing 1: 10=0.0587, 100=0.0274, 500=0.0228, 1000=0.0179, 2500=0.0125, 5000=0.0108, 25000=0.0079 (GBP); Package / Case: 0805 (2012 metric); Termination Style: SMD/SMT; Product: Thin Film Resistors SMD; Tolerance: 1 %; Case Code - in: 0805; Case Code - mm: 2012; Series: RT; Operating Temperature Range: - 55 C to + 125 C; Dimensions: 1.25 mm W x 2 mm L x 0.5 mm H; Packaging: Reel; ComponentLink1URL: https://datasheet.ciiva.com/2560/pyu-rt-1-to-0-05-rohs-l-5-2560882.pdf; ComponentLink1Description: https://datasheet.ciiva.com/2560/pyu-rt-1-to-0-05-rohs-l-5-2560882.pdf; ComponentLink2URL: https://datasheet.ciiva.com/7942/1392914-7942069.pdf; ComponentLink2Description: https://datasheet.ciiva.com/7942/1392914-7942069.pdf; ComponentLink3URL: https://datasheet.ciiva.com/12695/pyu-rt-1-to-0-05-rohs-l-4-12695301.pdf; ComponentLink3Description: https://datasheet.ciiva.com/12695/pyu-rt-1-to-0-05-rohs-l-4-12695301.pdf; Supplier Part Number 1: 1500665
R8 = PA0805-R-470RL: 0 Ohm Resistor, Jumper; Manufacturer: Yageo; Supplier 1: Digi-Key; Manufacturer Part Number: PA0805-R-470RL; Stock 1: 4968; Pricing 1: 1=0.63, 10=0.453, 25=0.3536, 50=0.299, 100=0.2356, 250=0.1994, 500=0.1631, 1000=0.1269 (USD); ComponentLink1URL: http://www.yageo.com/NewPortal/_en/search/productDocs.jsp?YageoPartNumber=PA0805-R-470RL; ComponentLink1Description: http://www.yageo.com/NewPortal/_en/search/productDocs.jsp?YageoPartNumber=PA0805-R-470RL; Supplier Part Number 1: YAG5758CT-ND
R9 R16 = RC0805FR-071ML: RES SMD 1M OHM 1% 1/8W 0805; Manufacturer: Yageo; Power (Watts): 0.125W, 1/8W; Temperature Coefficient: ±100ppm/°C; Supplier 1: Digi-Key; Manufacturer Part Number: RC0805FR-071ML; RoHS: RoHS Compliant; Category: Resistors; Stock 1: 66; Pricing 1: 1=0.1, 10=0.046, 100=0.0186, 1000=0.00835, 2500=0.00725 (USD); Packaging: Cut Tape (CT); Part Status: Active; Tolerance: ±1%; Composition: Thick Film; Features: Moisture Resistant; Operating Temperature: -55°C ~ 155°C; Package / Case: 0805 (2012 Metric); Supplier Device Package: 0805; Size / Dimension: 0.079" L x 0.049" W (2.00mm x 1.25mm); Height - Seated (Max): 0.024" (0.60mm); Failure Rate: -; ComponentLink1URL: http://www.yageo.com/documents/recent/PYu-RC_Group_51_RoHS_L_9.pdf; ComponentLink1Description: http://www.yageo.com/documents/recent/PYu-RC_Group_51_RoHS_L_9.pdf; Supplier Part Number 1: 311-1.00MCRCT-ND
R10-R12 R18 R19 = RC0805FR-071KL: RES SMD 1K OHM 1% 1/8W 0805; Manufacturer: Yageo; Power (Watts): 0.125W, 1/8W; Temperature Coefficient: ±100ppm/°C; Supplier 1: Digi-Key; Manufacturer Part Number: RC0805FR-071KL; RoHS: RoHS Compliant; Category: Resistors; Stock 1: 4264952; Pricing 1: 1=0.1, 10=0.046, 100=0.0186, 1000=0.00835, 2500=0.00725 (USD); Packaging: Cut Tape (CT); Part Status: Active; Tolerance: ±1%; Composition: Thick Film; Features: Moisture Resistant; Operating Temperature: -55°C ~ 155°C; Package / Case: 0805 (2012 Metric); Supplier Device Package: 0805; Size / Dimension: 0.079" L x 0.049" W (2.00mm x 1.25mm); Height - Seated (Max): 0.024" (0.60mm); Failure Rate: -; ComponentLink1URL: http://www.yageo.com/documents/recent/PYu-RC_Group_51_RoHS_L_9.pdf; ComponentLink1Description: http://www.yageo.com/documents/recent/PYu-RC_Group_51_RoHS_L_9.pdf; Supplier Part Number 1: 311-1.00KCRCT-ND
R14 R20-R23 = RC0805FR-0710KL: RES SMD 10K OHM 1% 1/8W 0805; Manufacturer: Yageo; Power (Watts): 0.125W, 1/8W; Temperature Coefficient: ±100ppm/°C; Supplier 1: Digi-Key; Manufacturer Part Number: RC0805FR-0710KL; RoHS: RoHS Compliant; Category: Resistors; Stock 1: 77138; Pricing 1: 1=0.1, 10=0.046, 100=0.0186, 1000=0.00835, 2500=0.00725 (USD); Packaging: Cut Tape (CT); Part Status: Active; Tolerance: ±1%; Composition: Thick Film; Features: Moisture Resistant; Operating Temperature: -55°C ~ 155°C; Package / Case: 0805 (2012 Metric); Supplier Device Package: 0805; Size / Dimension: 0.079" L x 0.049" W (2.00mm x 1.25mm); Height - Seated (Max): 0.024" (0.60mm); Failure Rate: -; ComponentLink1URL: http://www.yageo.com/documents/recent/PYu-RC_Group_51_RoHS_L_9.pdf; ComponentLink1Description: http://www.yageo.com/documents/recent/PYu-RC_Group_51_RoHS_L_9.pdf; Supplier Part Number 1: 311-10.0KCRCT-ND
SOCKET_FOR_U1 = 4828-3004-CP: SOCKET IC OPEN FRAME 28POS .3"; Manufacturer: 3M; Number of Contacts: 28; Pin Type: Stamped; Pitch: 2.54mm; Row Width: 7.62mm; Current Rating: 1A; Supplier 1: Digi-Key; Manufacturer Part Number: 4828-3004-CP; Stock 1: 14604; Pricing 1: 1=0.73, 10=0.638, 25=0.6, 50=0.575, 100=0.55, 250=0.5, 500=0.45, 1000=0.4, 2500=0.3625 (USD); Mounting Type: Through Hole; Frame Type: Open Frame; Termination Method: Solder; Contact Plating: Tin over Nickel; Orientation: Straight; Length: 35.43mm; Width: 10.16mm; Depth: 5.08mm; Dimensions: 35.43 x 10.16 x 5.08mm; Maximum Operating Temperature: +85°C; Series: 4800; Minimum Operating Temperature: -25°C; Housing Material: Glass-Filled PET; Contact Material: Phosphor Bronze; ComponentLink1URL: https://datasheet.ciiva.com/768/ts1099-768354.pdf; ComponentLink1Description: https://datasheet.ciiva.com/768/ts1099-768354.pdf; Supplier Part Number 1: 3M5480-ND
SW1 SW2 = 1825910-6: SWITCH TACTILE SPST-NO 0.05A 24V; Manufacturer: TE Connectivity ALCOSWITCH Switches; Switch Function: Off-Mom; Contact Rating @ Voltage: 0.05A @ 24VDC; Actuator Type: Standard; Actuator Height off PCB, Vertical: 5.00mm; Actuator Orientation: Top Actuated; Outline: 6.00mm x 6.00mm; Illumination: Non-Illuminated; Operating Force: 160gf; Actuator Material: Polybutylene Terephthalate (PBT); Switch Travel: 0.25mm; Mechanical Life: 100,000 Cycles; Supplier 1: Digi-Key; Manufacturer Part Number: 1825910-6; RoHS: RoHS Compliant; Category: Switches; Stock 1: 56296; Pricing 1: 1=0.1, 10=0.091, 25=0.0876, 50=0.0844, 100=0.0798, 250=0.07508, 500=0.07196, 1000=0.05475, 5000=0.04536 (USD); Packaging: Bulk; Part Status: Active; Circuit: SPST-NO; Mounting Type: Through Hole; Actuator Length, Right Angle: -; Termination Style: PC Pin; Illumination Type, Color: -; Illumination Voltage (Nominal): -; Ingress Protection: -; Features: -; Operating Temperature: -35°C ~ 85°C; ComponentLink1URL: http://www.te.com/commerce/DocumentDelivery/DDEController?Action=srchrtrv&DocNm=1825910&DocType=Customer+Drawing&DocLang=English; ComponentLink1Description: http://www.te.com/commerce/DocumentDelivery/DDEController?Action=srchrtrv&DocNm=1825910&DocType=Customer+Drawing&DocLang=English; Supplier Part Number 1: 450-1650-ND
U1 = ATMEGA16U2-AUR: IC MCU 8BIT 16KB FLASH 32TQFP; Manufacturer: Microchip Technology; Core Processor: AVR; Core Size: 8-Bit; Speed: 16MHz; Connectivity: SPI, UART/USART, USB; Peripherals: Brown-out Detect/Reset, POR, PWM, WDT; Program Memory Size: 16KB (8K x 16); EEPROM Size: 512 x 8; Voltage - Supply (Vcc/Vdd): 2.7 V ~ 5.5 V; Oscillator Type: Internal; Supplier 1: Digi-Key; RoHS: RoHS Compliant; Category: Integrated Circuits (ICs); Stock 1: 457; Pricing 1: 1=2.6, 25=2.3792, 100=2.1527 (USD); Packaging: Cut Tape (CT); Part Status: Active; Program Memory Type: FLASH; RAM Size: 512 x 8; Data Converters: -; Operating Temperature: -40°C ~ 85°C; Package / Case: 32-TQFP; Supplier Device Package: 32-TQFP (7x7); Base Part Number: ATMEGA16; ComponentLink1URL: http://www.microchip.com/mymicrochip/filehandler.aspx?ddocname=en590463; ComponentLink1Description: http://www.microchip.com/mymicrochip/filehandler.aspx?ddocname=en590463; Supplier Part Number 1: ATMEGA16U2-AURCT-ND; Manufacturer Part Number: ATMEGA16U2-AUR
U2 = ATMEGA328P-PU: IC MCU 8BIT 32KB FLASH 28DIP; Manufacturer: Microchip Technology; Core Processor: AVR; Core Size: 8-Bit; Speed: 20MHz; Connectivity: I²C, SPI, UART/USART; Peripherals: Brown-out Detect/Reset, POR, PWM, WDT; Program Memory Size: 32KB (16K x 16); EEPROM Size: 1K x 8; RAM Size: 2K x 8; Voltage - Supply (Vcc/Vdd): 1.8 V ~ 5.5 V; Data Converters: A/D 6x10b; Oscillator Type: Internal; Supplier 1: Digi-Key; Manufacturer Part Number: ATMEGA328P-PU; RoHS: RoHS Compliant; Category: Integrated Circuits (ICs); Stock 1: 5410; Pricing 1: 1=2.14, 25=1.9672, 100=1.7819 (USD); Packaging: Tube; Part Status: Active; Program Memory Type: FLASH; Operating Temperature: -40°C ~ 85°C (TA); Package / Case: 28-DIP (0.300", 7.62mm); Supplier Device Package: 28-PDIP; Base Part Number: ATMEGA328; ComponentLink1URL: http://www.microchip.com/mymicrochip/filehandler.aspx?ddocname=en589968; ComponentLink1Description: http://www.microchip.com/mymicrochip/filehandler.aspx?ddocname=en589968; Supplier Part Number 1: ATMEGA328P-PU-ND
U3 = TL1963A-33DCQR: IC REG LDO 3.3V 1.5A SOT223-6; Manufacturer: Texas Instruments; Regulator Output Type: Fixed; Polarity Type: Positive; Number of Outputs: 1; Input Voltage (Min): 1.9V; Input Voltage: 20V; Load Regulation: 20mV; Line Regulation: 10mV; Supplier 1: Digi-Key; Manufacturer Part Number: TL1963A-33DCQR; Stock 1: 801; Pricing 1: 1=2.88, 10=2.589, 100=2.121, 500=1.8055, 1000=1.5228 (USD); Voltage Regulator Type: LDO; Topology: LDO; Output Voltage: 3.3V; Package Type: SOT-223; Packaging: Tape and Reel; Output Current: 1.5A; Operating Temp Range: -40C to 125C; Operating Temperature Classification: Automotive; Pin Count: 5 +Tab; Mounting: Surface Mount; ComponentLink1URL: https://datasheet.ciiva.com/2046/tl1963a-2046161.pdf; ComponentLink1Description: https://datasheet.ciiva.com/2046/tl1963a-2046161.pdf; ComponentLink2URL: https://datasheet.ciiva.com/2046/tl1963a-2046162.pdf; ComponentLink2Description: https://datasheet.ciiva.com/2046/tl1963a-2046162.pdf; ComponentLink3URL: https://datasheet.ciiva.com/2046/tl1963a-2046163.pdf; ComponentLink3Description: https://datasheet.ciiva.com/2046/tl1963a-2046163.pdf; ComponentLink4URL: https://datasheet.ciiva.com/26176/tl1963a-25-26176569.pdf; ComponentLink4Description: https://datasheet.ciiva.com/26176/tl1963a-25-26176569.pdf; Supplier Part Number 1: 296-24534-6-ND
U4-U7 = SN74AHC1G09DBVR: IC GATE AND 1CH 2-INP SOT23-5; Manufacturer: Texas Instruments; Logic Type: AND Gate; Number of Inputs: 2; Voltage - Supply: 2 V ~ 5.5 V; Current - Output High, Low: -, 8mA; Logic Level - Low: 0.5 V ~ 1.65 V; Logic Level - High: 1.5 V ~ 3.85 V; Max Propagation Delay @ V, Max CL: 7.5ns @ 5V, 50pF; Supplier 1: Digi-Key; Manufacturer Part Number: SN74AHC1G09DBVR; RoHS: RoHS Compliant; Category: Integrated Circuits (ICs); Stock 1: 49237; Pricing 1: 1=0.43, 10=0.32, 100=0.1996, 500=0.13658, 1000=0.10506 (USD); Packaging: Cut Tape (CT); Part Status: Active; Features: Open Drain; Operating Temperature: -55°C ~ 125°C; Mounting Type: Surface Mount; Supplier Device Package: SOT-23-5; Package / Case: SC-74A, SOT-753; Base Part Number: 74AHC1G09; ComponentLink1URL: http://www.ti.com/lit/ds/symlink/sn74ahc1g09.pdf; ComponentLink1Description: http://www.ti.com/lit/ds/symlink/sn74ahc1g09.pdf; Supplier Part Number 1: 296-29202-1-ND
Y1 Y2 = ABM7-16.000MHZ-D2Y-T: CRYSTAL 16.0000MHZ 18PF SMD; Manufacturer: Abracon LLC; Frequency Stability: ±30ppm; Frequency Tolerance: ±20ppm; Operating Mode: Fundamental; Supplier 1: Digi-Key; Manufacturer Part Number: ABM7-16.000MHZ-D2Y-T; RoHS: RoHS Compliant; Category: Crystals, Oscillators, Resonators; Stock 1: 71571; Pricing 1: 1=0.72, 10=0.633, 50=0.5912, 100=0.5225, 500=0.495 (USD); Packaging: Cut Tape (CT); Part Status: Active; Type: MHz Crystal; Load Capacitance: 18pF; Operating Temperature: -40°C ~ 85°C; Ratings: -; Mounting Type: Surface Mount; Package / Case: 2-SMD, No Lead; Size / Dimension: 0.236" L x 0.138" W (6.00mm x 3.50mm); Height - Seated (Max): 0.055" (1.40mm); ComponentLink1URL: https://abracon.com/Resonators/abm7.pdf; ComponentLink1Description: https://abracon.com/Resonators/abm7.pdf; Supplier Part Number 1: 535-9840-1-ND
Z1 Z2 = CG0603MLC-05E: BOURNS         CG0603MLC-05E            TVS Varistor, AEC-Q200 ChipGuard MLC Series, 8 V, 5 V, 20 V, 0603 [1608 Metric], ESD Protector; Capacitance: 0.5 pF; Channels: 1 Channel; Case Width: 0.8 mm; Operating Voltage: 5 V; Clamping Voltage: 20 V; Current Rating: 50 nA; Supplier 1: Digi-Key; Manufacturer: Bourns; Manufacturer Part Number: CG0603MLC-05E; Stock 1: 201230; Pricing 1: 1=0.51, 10=0.359, 25=0.2944, 100=0.2357, 250=0.1714, 500=0.1393, 1000=0.1071, 2500=0.0964 (USD); Brand: Bourns; Case Code - in: 0603; Case Code - mm: 1608; Operating Temperature Range: - 40 C to + 85 C; Dimensions: 0.8 mm W x 1.6 mm L x 0.8 mm H; Mounting: SMD/SMT; Factory Pack Quantity: 5000; Product Category: Varistors; RoHS: Details; Product: MLV; Voltage Rating DC: 5 V; Termination Style: SMD/SMT; Packaging: Reel; Package / Case: 0603 (1608 metric); Series: MLC; Tradename: ChipGuard; Voltage: 5 V; Width: 0.8 mm; ComponentLink1URL: https://datasheet.ciiva.com/30070/mlc-30070503.pdf; ComponentLink1Description: https://datasheet.ciiva.com/30070/mlc-30070503.pdf; ComponentLink2URL: https://datasheet.ciiva.com/6991/mlc-6991832.pdf; ComponentLink2Description: https://datasheet.ciiva.com/6991/mlc-6991832.pdf; ComponentLink3URL: https://datasheet.ciiva.com/6991/mlc-6991834.pdf; ComponentLink3Description: https://datasheet.ciiva.com/6991/mlc-6991834.pdf; ComponentLink4URL: https://datasheet.ciiva.com/6991/mlc-6991836.pdf; ComponentLink4Description: https://datasheet.ciiva.com/6991/mlc-6991836.pdf; ComponentLink5URL: https://datasheet.ciiva.com/1278/1785244-1278701.pdf; ComponentLink5Description: https://datasheet.ciiva.com/1278/1785244-1278701.pdf; ComponentLink6URL: https://datasheet.ciiva.com/27747/1163231-27747629.pdf; ComponentLink6Description: https://datasheet.ciiva.com/27747/1163231-27747629.pdf; ComponentLink7URL: https://datasheet.ciiva.com/22696/1785244-22696318.pdf; ComponentLink7Description: https://datasheet.ciiva.com/22696/1785244-22696318.pdf; ComponentLink8URL: https://datasheet.ciiva.com/25958/mlc-25958222.pdf; ComponentLink8Description: https://datasheet.ciiva.com/25958/mlc-25958222.pdf; ComponentLink9URL: https://datasheet.ciiva.com/8084/mlc-8084047.pdf; ComponentLink9Description: https://datasheet.ciiva.com/8084/mlc-8084047.pdf; Supplier Part Number 1: CG0603MLC-05ECT-ND